# EAGLE design LEDMatrix (EAGLE 6.3)
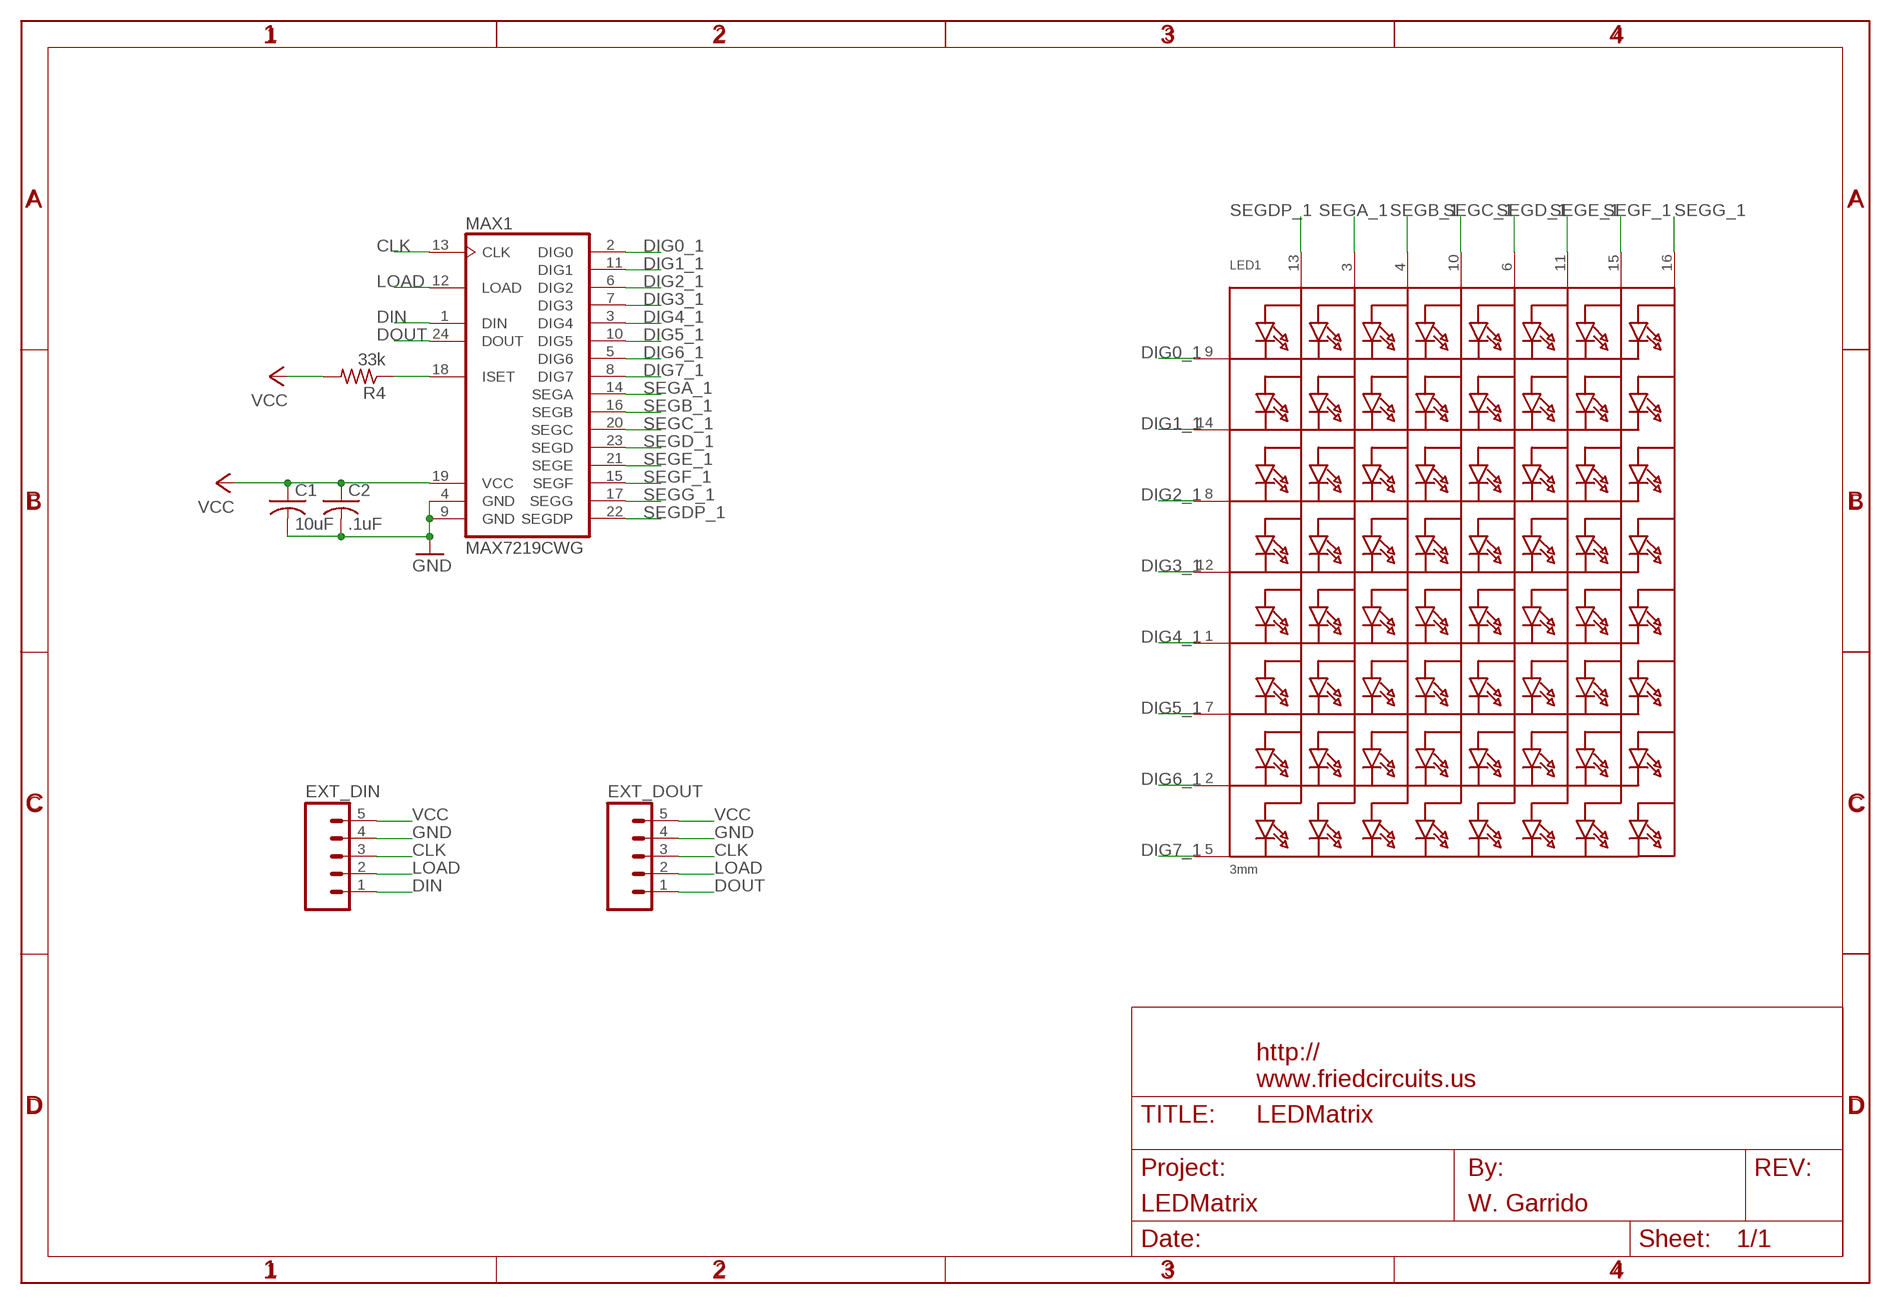
[diagram p0: schematic, sheet 1]

## Parts
C1  10uF  C-USC0805  [C0805]
C2  .1uF  C-USC0805  [C0805]
EXT_DIN  M05LOCK_LONGPADS  [1X05_LOCK_LONGPADS]
EXT_DOUT  M05LOCK_LONGPADS  [1X05_LOCK_LONGPADS]
LED1  3mm  SEGMENT_8X8_ROWCATHODEM12A881UR  [SEGMENT_BL-M12A881UR]
MAX1  MAX7219CWG  [SO24W]
R4  33k  R-US_M0805  [M0805]
U$1  FRAME_DINA4_L  [FC_CREDIT]

## Nets
CLK: EXT_DIN.3 EXT_DOUT.3 MAX1.13(CLK)
DIG0_1: LED1.9(K1) MAX1.2(DIG0)
DIG1_1: LED1.14(K2) MAX1.11(DIG1)
DIG2_1: LED1.8(K3) MAX1.6(DIG2)
DIG3_1: LED1.12(K4) MAX1.7(DIG3)
DIG4_1: LED1.1(K5) MAX1.3(DIG4)
DIG5_1: LED1.7(K6) MAX1.10(DIG5)
DIG6_1: LED1.2(K7) MAX1.5(DIG6)
DIG7_1: LED1.5(K8) MAX1.8(DIG7)
DIN: EXT_DIN.1 MAX1.1(DIN)
DOUT: EXT_DOUT.1 MAX1.24(DOUT)
GND: C1.2 C2.2 EXT_DIN.4 EXT_DOUT.4 MAX1.4(GND) MAX1.9(GND)
LOAD: EXT_DIN.2 EXT_DOUT.2 MAX1.12(LOAD)
N$32: MAX1.18(ISET) R4.1
SEGA_1: LED1.3(A2) MAX1.14(SEGA)
SEGB_1: LED1.4(A3) MAX1.16(SEGB)
SEGC_1: LED1.10(A4) MAX1.20(SEGC)
SEGD_1: LED1.6(A5) MAX1.23(SEGD)
SEGDP_1: LED1.13(A1) MAX1.22(SEGDP)
SEGE_1: LED1.11(A6) MAX1.21(SEGE)
SEGF_1: LED1.15(A7) MAX1.15(SEGF)
SEGG_1: LED1.16(A8) MAX1.17(SEGG)
VCC [VCC]: C1.1 C2.1 EXT_DIN.5 EXT_DOUT.5 MAX1.19(VCC) R4.2

## Library data of the parts
C1 C2 = adafruit:C-US: CAPACITOR, American symbol
EXT_DIN EXT_DOUT = SparkFun-Connectors:M05: Header 5 Standard 5-pin 0.1" header. Use with straight break away headers (SKU : PRT-00116), right angle break away headers (PRT-00553), swiss pins (PRT-00743), machine pins (PRT-00117), and female headers (PRT-00115). Molex polarized connector foot print use with SKU : PRT-08230 with associated crimp pins and housings.
LED1 = adafruit:SEGMENT_8X8_ROWCATHODE: 8x8 LED Segment Displays: Row = Cathode 0.7" Red 8X8 Matrix, 1.9mm Round LEDs - BL-M07C881UR 1.2" Red 8x8 Matrix, 3.0mm Round LEDs - BL-M12A881UR 1.2" Red 8x8 Matrix, 3.0mm Square LEDs - BL-M12A883
MAX1 = maxim-5:MAX7219*: Serially Interfaced, 8-Digit LED Display Drivers
R4 = adafruit:R-US_: RESISTOR, American symbol
U$1 = FriedCircuits:FRAME_DINA4_L: A4 FC frame Standard FriedCircuits schematic frame. Automagically adds the standard texts to the PCB Use the atrribute in the schematic editor to change the fields.; AUTHOR: W. Garrido; FF1: fulfillment by; FF2: FriedCircuits; FF3: www.friedcircuits.us; PROJECT: LEDMatrix; URL1: http://; URL2: www.friedcircuits.us

## Net classes
0 default: width 0.203 mm, drill 0.203 mm
1 VCC: width 0.254 mm, drill 0.254 mm

## Board
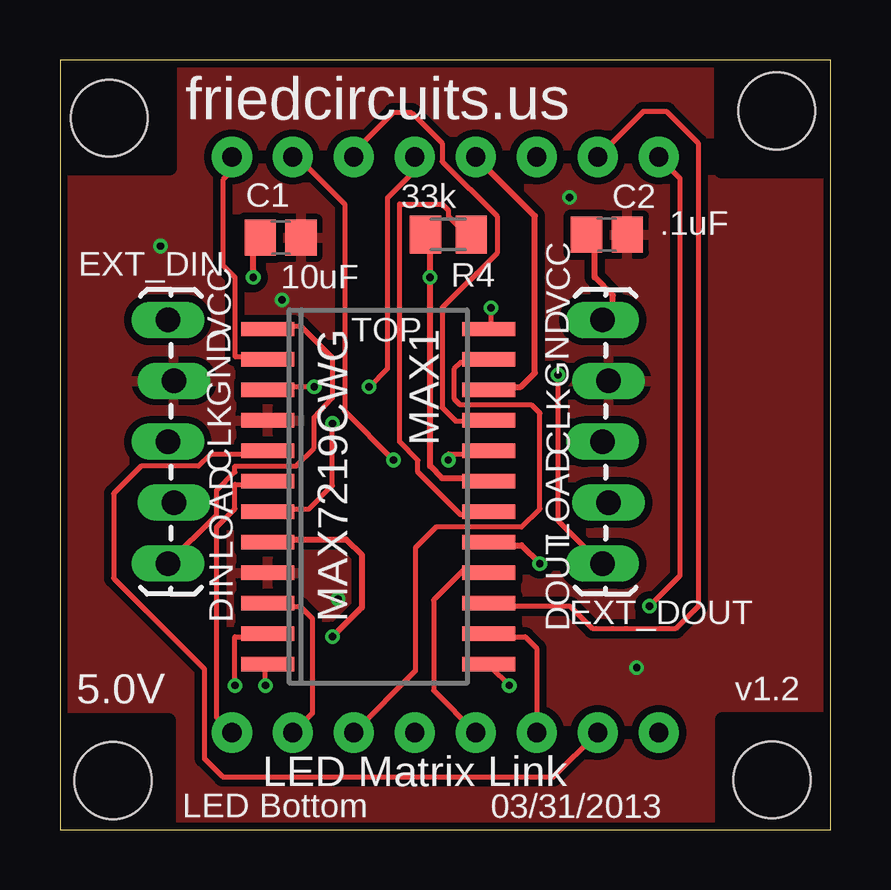
[diagram p1: board, top side]
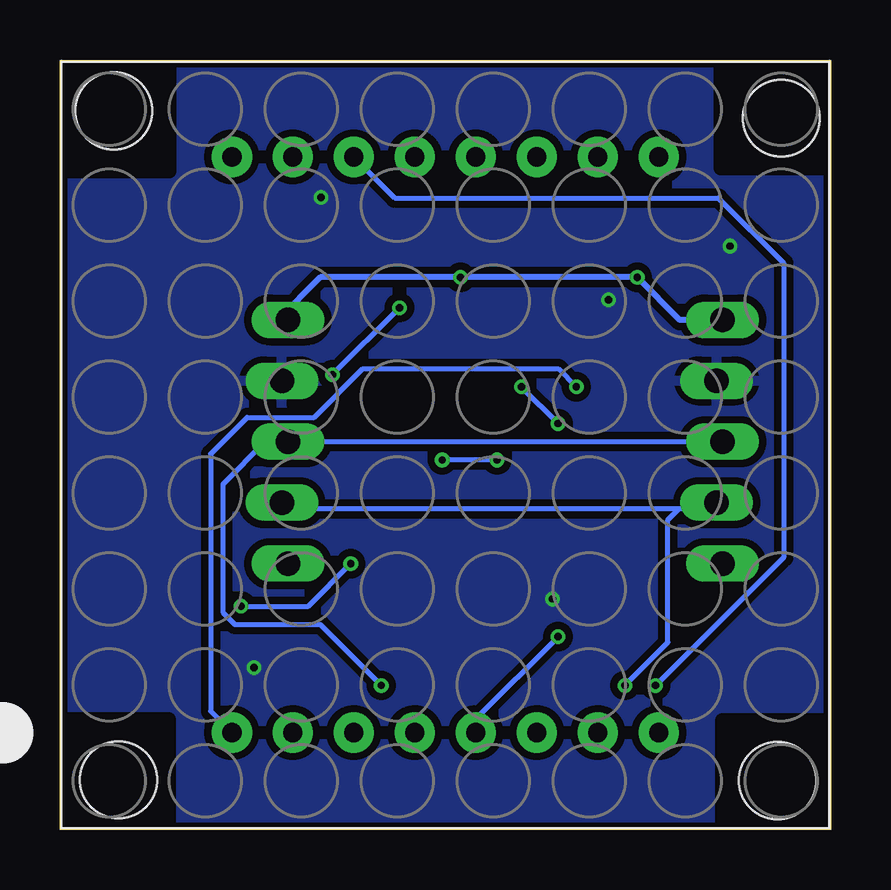
[diagram p2: board, bottom side, seen from below]

Size 32.11 x 32.1 mm. Coordinates in mm from the lower left corner, seen from the top.
Outline: 0,0 32.11,0 32.11,32.1 0,32.1 0,0
Copper layers (1*16): Top 0.035mm / dielectric 1.5mm / Bottom 0.035mm
Design rules "Fusion_eagle_rule_v1.1": minimum track width 6mil, minimum drill 12mil, track to track 6mil, track to pad 6mil, pad to pad 6mil, via to via 6mil, smd to smd 0mil, copper to edge 10mil, drill to drill 10mil, minimum pad ring 10mil, minimum via ring 6mil, stop-mask expansion 2mil, vias tented up to drill 100mil, thermal gap 10mil
Holes 3.2 mm at 29.87,29.97 2.21,2.06 29.67,2.08 2.06,29.67
tRestrict: area 27.6,27.5 to 32,31.9; area 0.1,0.1 to 4.5,4.6; area 27.6,0.1 to 32,4.6; area 0.1,27.6 to 4.6,32
bRestrict: area 27.6,27.5 to 32,31.9; area 0.1,0.1 to 4.5,4.6; area 27.6,0.1 to 32,4.6; area 0.1,27.6 to 4.6,32

### Footprints (pad centres in the part's own frame; a part is rotated, then mirrored left to right if it is on the bottom)
C0805 = smd 1.3 x 1.5: 1 -0.85,0; 2 0.85,0
1X05_LOCK_LONGPADS = drill 1.016 long: 1 0,0; 2 2.54,-0.254; 3 5.08,0; 4 7.62,-0.254; 5 10.16,0
SEGMENT_BL-M12A881UR = drill 0.8 pad 1.676: 1 -8.89,-12; 2 -6.35,-12; 3 -3.81,-12; 4 -1.27,-12; 5 1.27,-12; 6 3.81,-12; 7 6.35,-12; 8 8.89,-12; 9 8.89,12; 10 6.35,12; 11 3.81,12; 12 1.27,12; 13 -1.27,12; 14 -3.81,12; 15 -6.35,12; 16 -8.89,12
SO24W = smd 0.6 x 2.2: 1 -6.985,-4.6; 2 -5.715,-4.6; 3 -4.445,-4.6; 4 -3.175,-4.6; 5 -1.905,-4.6; 6 -0.635,-4.6; 7 0.635,-4.6; 8 1.905,-4.6; 9 3.175,-4.6; 10 4.445,-4.6; 11 5.715,-4.6; 12 6.985,-4.6; 13 6.985,4.6; 14 5.715,4.6; 15 4.445,4.6; 16 3.175,4.6; 17 1.905,4.6; 18 0.635,4.6; 19 -0.635,4.6; 20 -1.905,4.6; 21 -3.175,4.6; 22 -4.445,4.6; 23 -5.715,4.6; 24 -6.985,4.6
M0805 = smd 1.3 x 1.6: 1 -0.95,0; 2 0.95,0

### Placement (x,y rotation side)
C1  9.19,24.69 0 top
C2  22.78,24.82 0 top
EXT_DIN  4.5,11.1 90 top
EXT_DOUT  22.61,11.1 90 top
LED1  16.05,16.05 0 bottom
MAX1  13.26,13.89 270 top
R4  16.18,24.82 180 top
U$1  32.94,13.89 0 top

### Tracks (layer width: path | path; a pad name or v marks a point on that pad's centre or on a via)
CLK  (via drill 0.3)
  Top 0.203: v18.72,6.02 17.96,6.78 MAX1.13
  Bottom 0.203: v18.72,6.02 21.26,8.56 24.82,8.56 25.32,9.07 25.32,14.4 23.55,16.18 EXT_DOUT.3 EXT_DIN.3
DIG0_1
  Top 0.203: MAX1.2 8.56,19.74 7.29,19.74 7.29,23.04 6.78,23.55 6.78,27.1 7.04,27.36 7.04,27.86 LED1.9
DIG1_1  (via drill 0.3)
  Top 0.203: v7.29,6.02 7.29,8.05 8.56,8.05 MAX1.11
  Bottom 0.203: v7.29,6.02 1.96,11.35 1.96,23.62 4.67,26.34 18.15,26.34 LED1.14
DIG2_1
  Top 0.203: MAX1.6 8.56,14.4 7.29,14.4 7.29,13.39 6.53,12.62 6.53,4.69 LED1.8
DIG3_1  (via drill 0.3)
  Top 0.203: v12.88,18.47 13.64,19.23 13.64,26.34 14.66,27.36 14.66,27.86 LED1.12 | MAX1.7 8.81,13.39 10.39,13.39 11.35,14.35 v11.35,16.94
  Bottom 0.203: v12.88,18.47 v11.35,16.94
DIG4_1  (via drill 0.3)
  Top 0.203: v10.59,18.47 8.81,18.47 MAX1.3
  Bottom 0.203: v10.59,18.47 11.35,19.23 19.48,19.23 21.51,17.2 24.31,17.2 25.83,15.67 25.83,4.94 LED1.1
DIG5_1
  Top 0.203: MAX1.10 8.81,9.32 10.01,9.32 10.52,8.81 10.52,4.87 LED1.7
DIG6_1
  Top 0.203: MAX1.5 8.56,15.67 6.27,15.67 5.77,15.16 3.38,15.16 2.23,14.02 2.23,10.49 6.02,6.71 6.02,2.97 6.78,2.21 20.56,2.21 LED1.2
DIG7_1  (via drill 0.3)
  Top 0.203: 8.81,12.12 MAX1.8
  Top 0.254: 8.81,12.12 11.91,12.12 12.57,11.46 12.57,9.27 v11.35,8.05
  Bottom 0.203: LED1.5 14.78,4.62 v11.35,8.05
DIN
  Top 0.203: EXT_DIN.1 6.53,13.13 6.53,14.15 7.29,14.91 7.29,15.16 9.83,15.16 10.59,15.93 10.59,17.2 11.33,17.98 11.35,18.01 11.35,19.68 10.03,21.01 8.81,21.01 MAX1.1
DOUT  (via drill 0.3)
  Top 0.203: v17.96,21.77 17.96,21.01 MAX1.24 | v20.75,18.97 20.75,12.88 22.53,11.1 EXT_DOUT.1
  Bottom 0.203: v20.75,18.97 v17.96,21.77
GND  (via drill 0.3)
  other vias: 11.58,9.63 9.25,22.1 21.23,26.37 4.19,24.33 24.03,6.76
  pour Top (isolate 0.305): -0.08,-0.08 32.18,-0.08 32.18,32.18 -0.08,32.18
  pour Bottom (isolate 0.305): -0.08,-0.08 32.18,-0.08 32.18,0.43 32.18,32.18 -0.08,32.18 -0.08,31.93
LOAD  (via drill 0.3)
  Top 0.203: v8.56,6.02 8.56,6.78 MAX1.12
  Bottom 0.203: EXT_DIN.2 5,13.39 6.32,13.39 | 6.32,13.39 23.04,13.39 23.29,13.64 EXT_DOUT.2 | v8.56,6.02 8.56,6.04 6.78,7.82 6.78,12.93 6.32,13.39
N$32
  Top 0.203: R4.1 16.94,24.82 16.18,25.58 16.18,25.83 15.93,26.09 14.15,26.09 14.15,16.18 14.91,15.42 14.91,14.91 16.69,13.13 17.7,13.13 MAX1.18
SEGA_1
  Top 0.203: MAX1.14 17.96,8.05 19.38,8.05 19.86,7.57 LED1.3
SEGB_1
  Top 0.203: 17.7,10.85 MAX1.16 | 16.84,10.85 15.57,9.58 15.57,5.81 LED1.4
  Top 0.254: 17.7,10.85 16.84,10.85
SEGC_1  (via drill 0.3)
  Top 0.203: v16.18,15.42 16.18,15.67 17.7,15.67 MAX1.20 | v13.89,15.42 11.86,17.45 11.86,26.09 9.83,28.12 LED1.10
  Bottom 0.203: v13.89,15.42 v16.18,15.42
SEGD_1
  Top 0.203: MAX1.23 17.7,19.48 16.69,19.48 16.41,19.2 16.41,17.98 16.66,17.73 19.63,17.73 19.99,17.37 19.99,13.39 19.23,12.62 15.67,12.62 14.81,11.76 14.81,6.62 LED1.6
SEGDP_1
  Top 0.203: 17.96,18.47 MAX1.22
  Top 0.254: 17.96,18.47 19.2,18.47 19.79,19.05 19.79,25.59 LED1.13
SEGE_1
  Top 0.203: 17.7,17.2 MAX1.21 17.83,17.04 16.48,17.04 15.93,17.6 15.93,21.77 18.21,24.05 18.21,25.58 15.93,27.86 15.93,28.63 14.66,29.9 13.89,29.9 12.37,28.37 12.37,28.12 LED1.11
SEGF_1
  Top 0.203: MAX1.15 17.96,9.32 21.26,9.32 22.2,8.38 25.65,8.38 26.59,9.32 26.59,28.63 25.27,29.95 24.3,29.95 LED1.15
SEGG_1  (via drill 0.3)
  Top 0.203: v24.56,9.32 25.83,10.59 25.83,27.16 LED1.16 | 17.96,11.86 MAX1.17
  Top 0.254: 17.96,11.86 19.23,11.86 v19.99,11.1
  Bottom 0.203: v19.99,11.1 21.77,9.32 v24.56,9.32
VCC  (via drill 0.3)
  Top 0.254: R4.2 15.42,24.82 v15.42,23.04 15.42,15.16 15.93,14.66 17.7,14.66 MAX1.19 | C2.1 22.02,24.82 22.28,24.56 22.28,23.04 23.04,22.28 23.04,21.26 EXT_DOUT.5 | v8.05,23.04 8.05,24.31 8.31,24.56 C1.1
  Bottom 0.254: EXT_DIN.5 6.27,21.26 v8.05,23.04 v15.42,23.04 21.26,23.04 23.04,21.26 EXT_DOUT.5

### Text on the board
tPlace: VCC | VCC | TOP | GND | GND | CLK | CLK | LOAD | LOAD | DIN | DOUT | 5.0V | v1.2 | LED Matrix Link
tNames: friedcircuits.us | LED Bottom | 03/31/2013